# Altium schematic sheet 0162_CPU PD BOM -2.SchDoc
size 848 x 558 mm
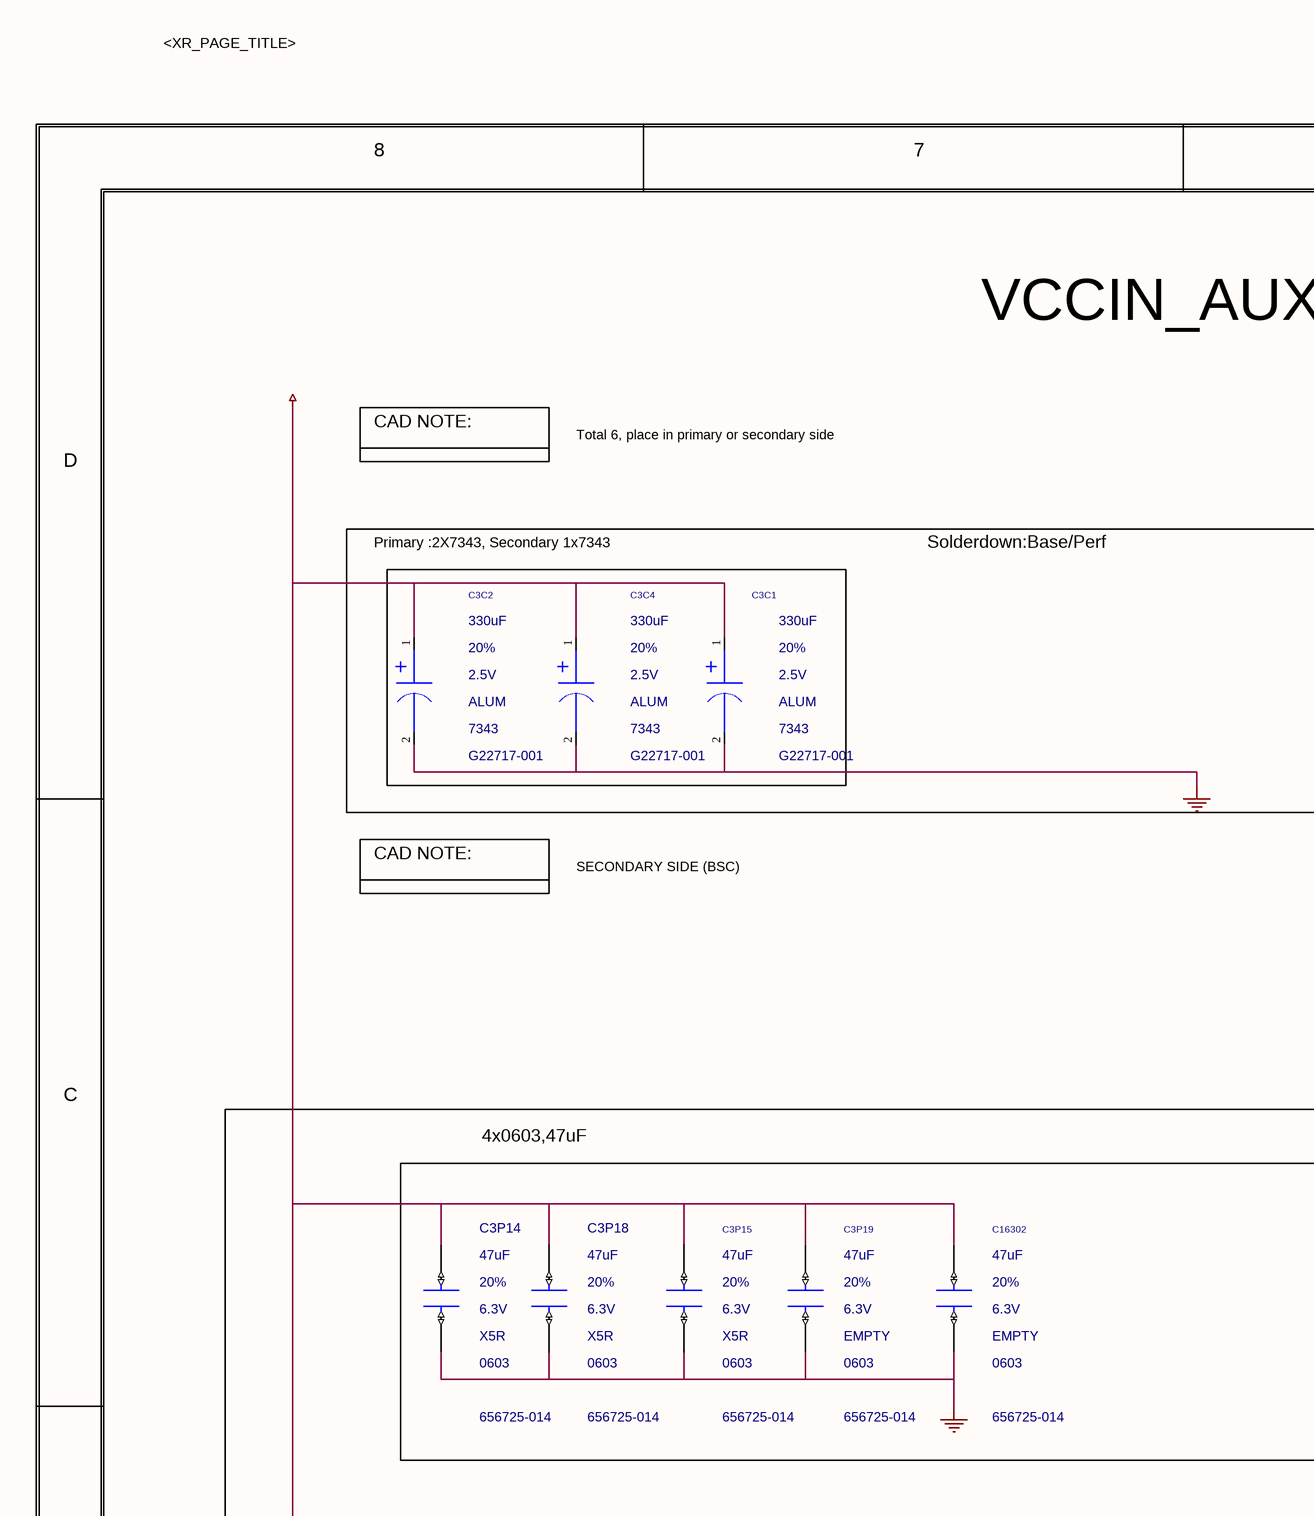
[diagram p0: 0162_CPU PD BOM -2.SchDoc, top left]
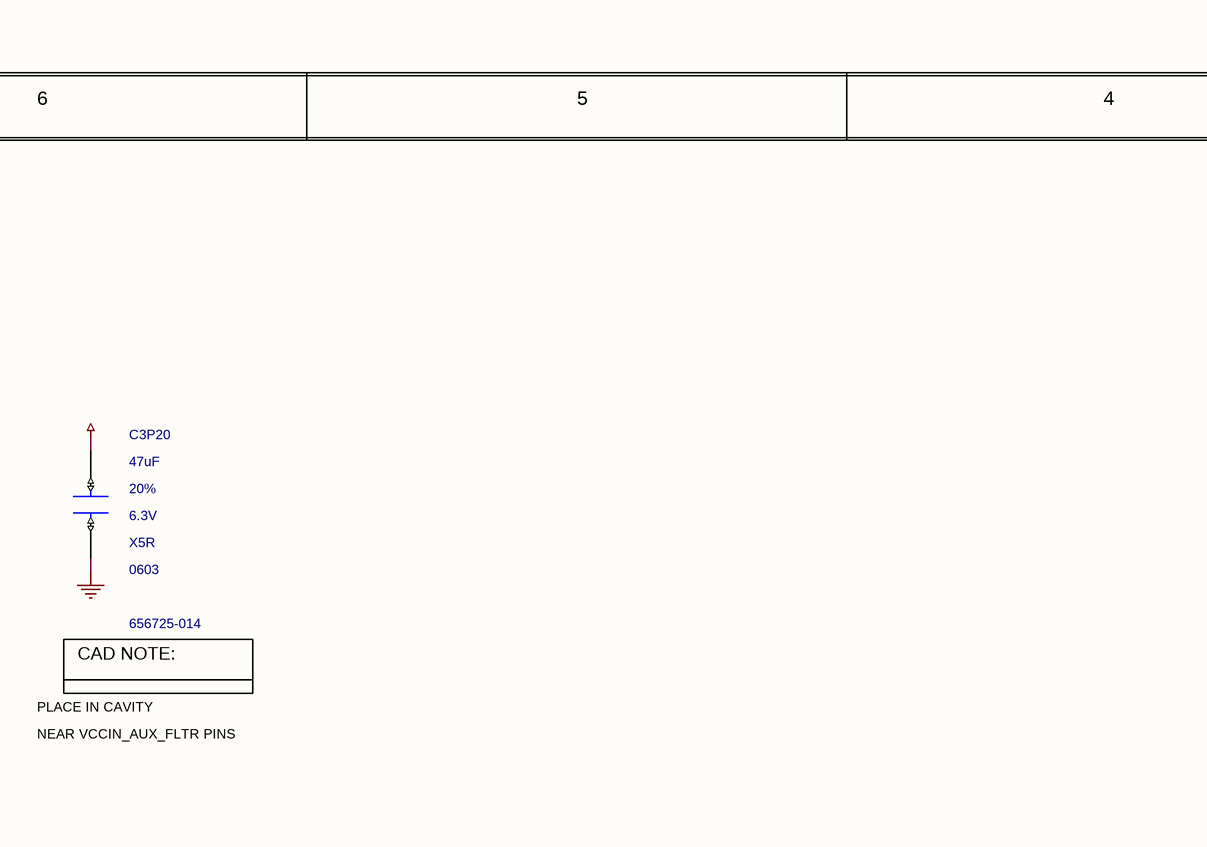
[diagram p1: 0162_CPU PD BOM -2.SchDoc, top middle]
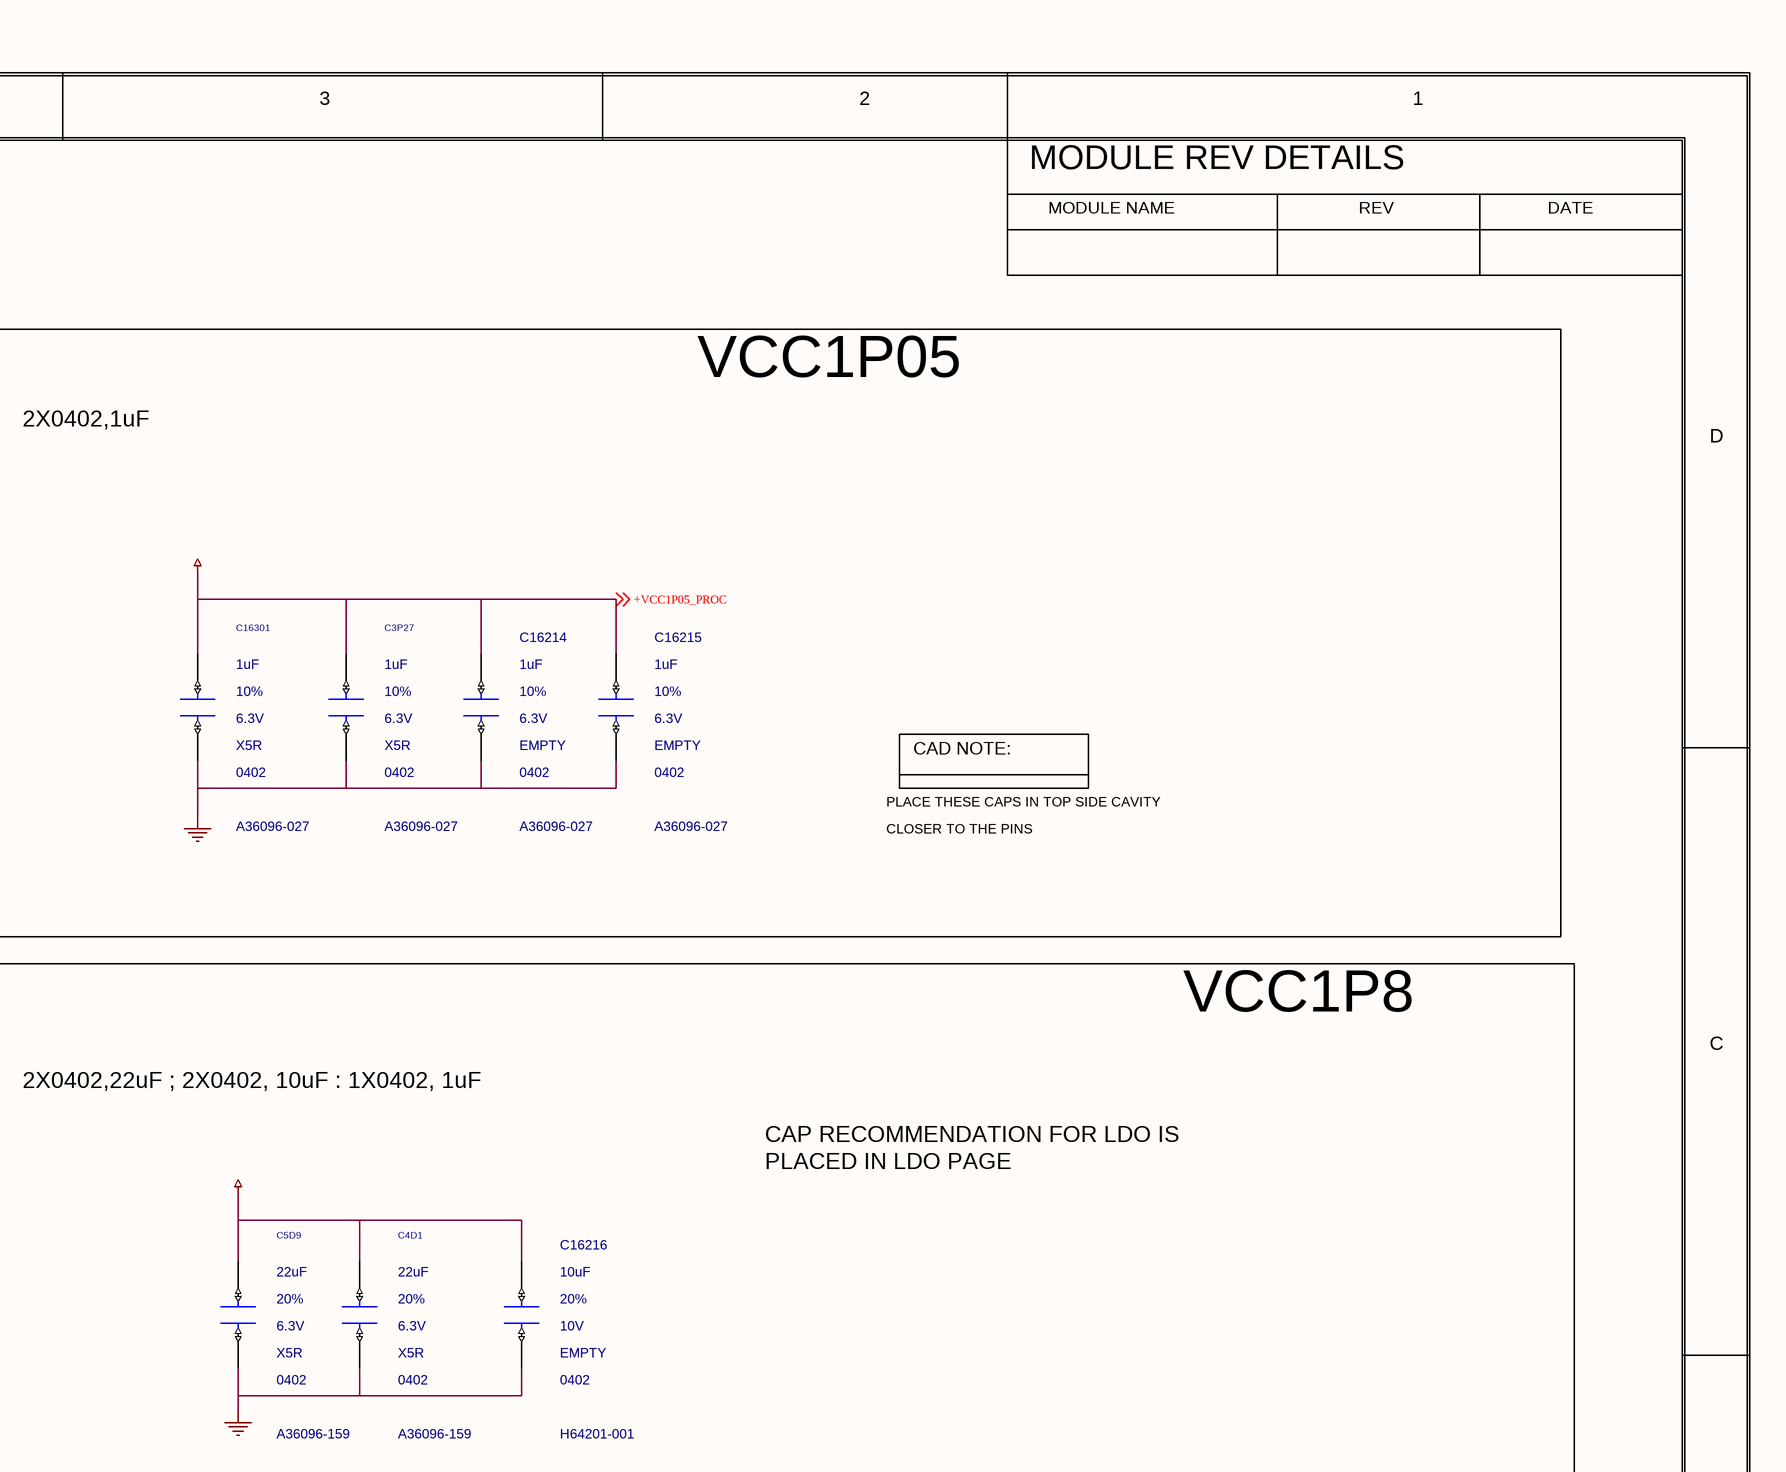
[diagram p2: 0162_CPU PD BOM -2.SchDoc, top right]
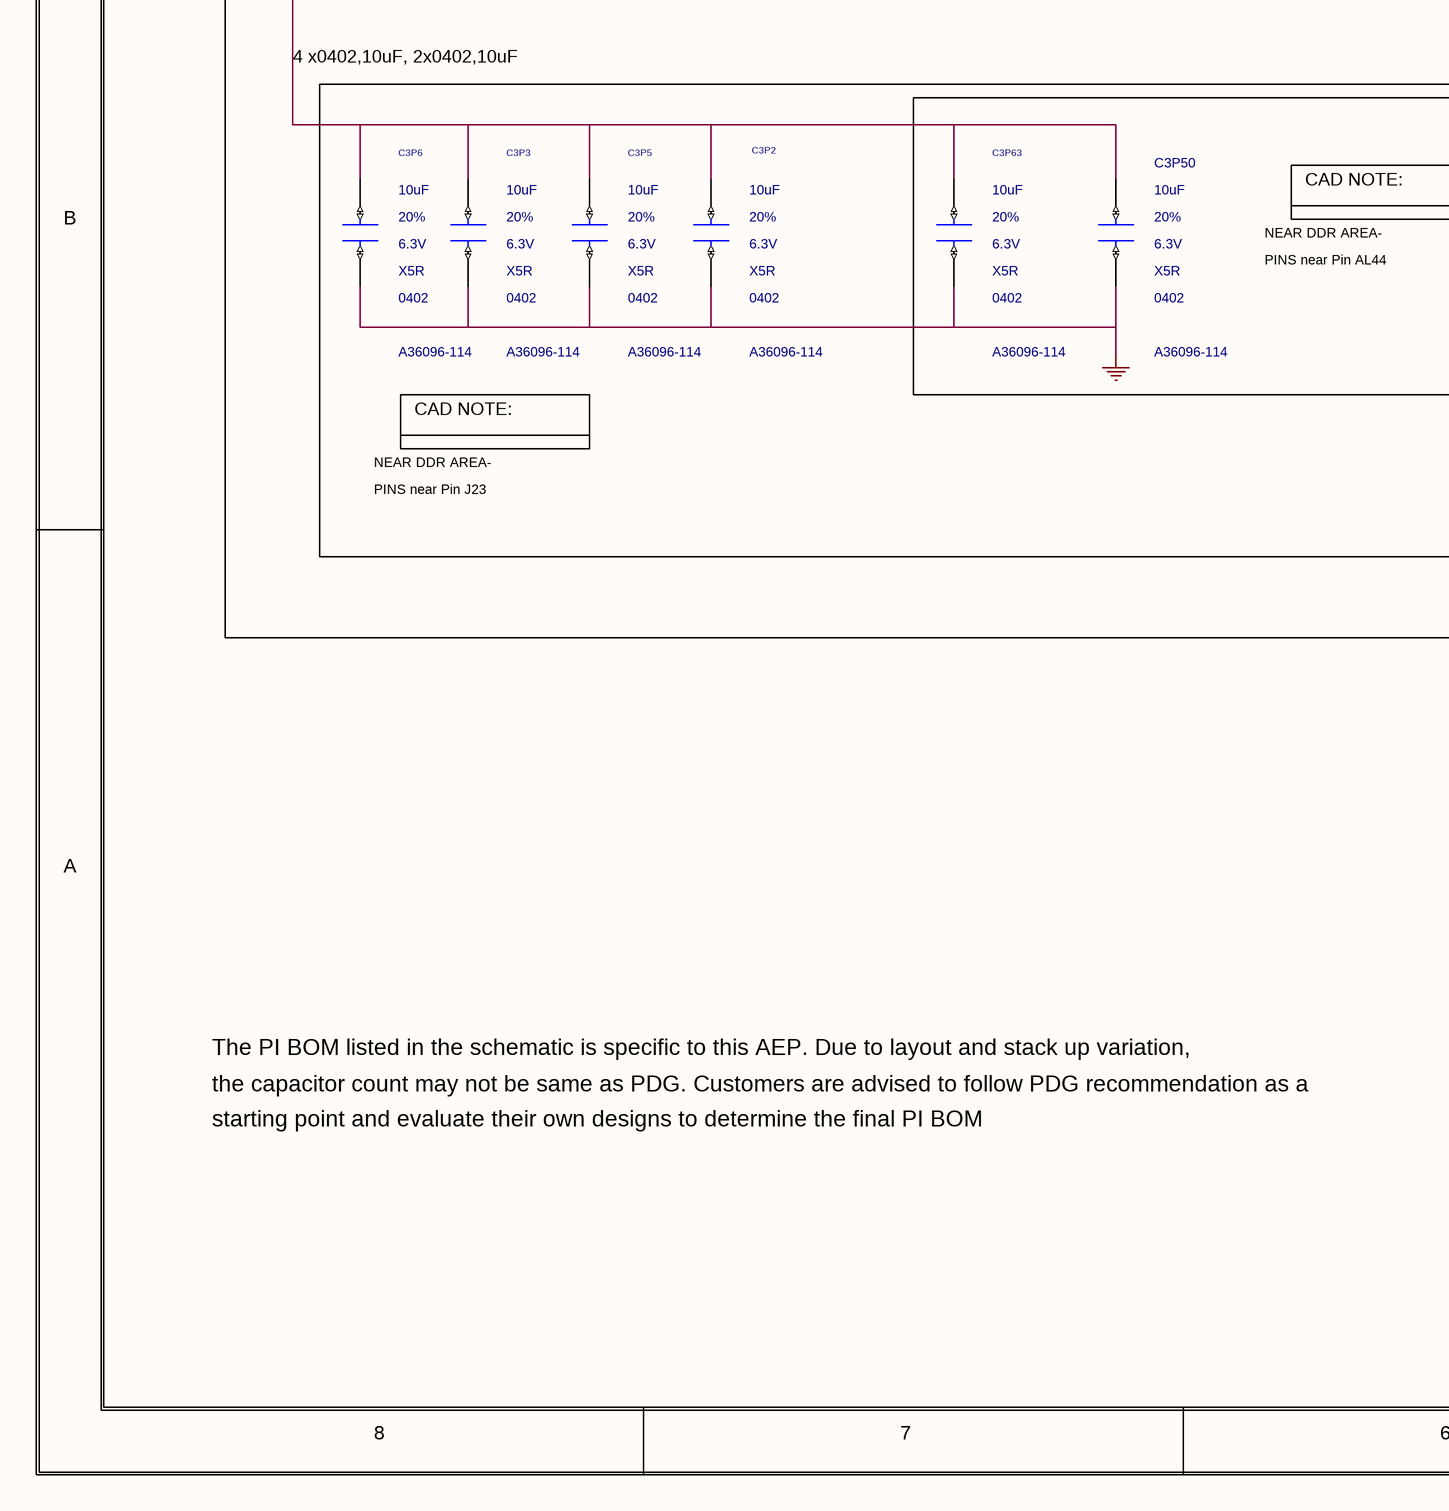
[diagram p3: 0162_CPU PD BOM -2.SchDoc, bottom left]
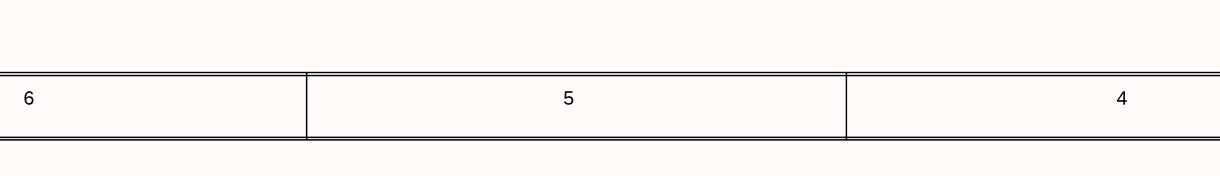
[diagram p4: 0162_CPU PD BOM -2.SchDoc, bottom middle]
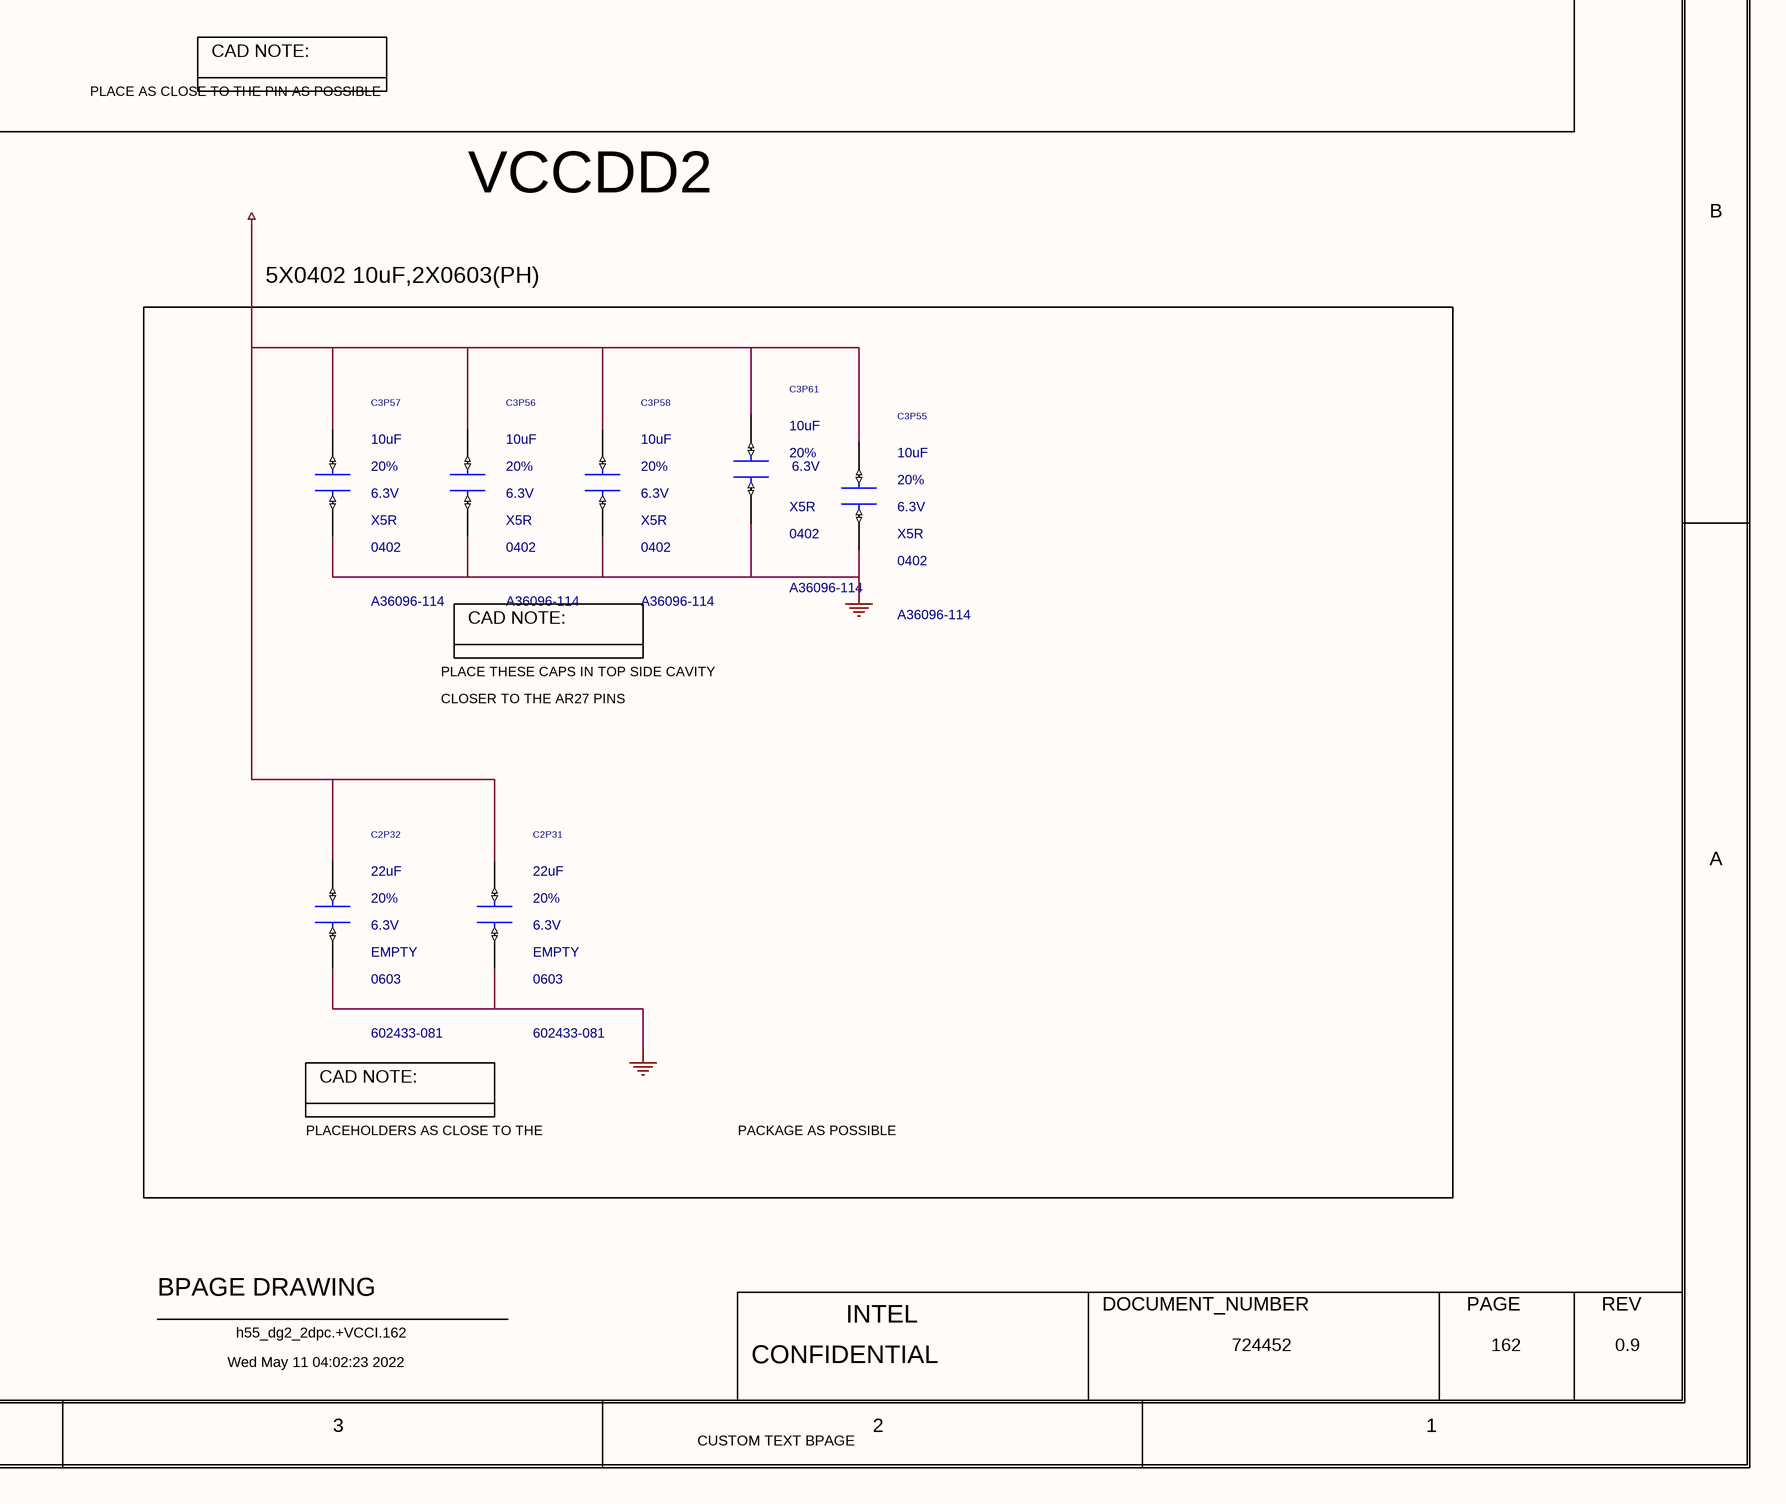
[diagram p5: 0162_CPU PD BOM -2.SchDoc, bottom right]

## Parts
C2P31  22uF  MATERIAL: EMPTY  PACK_TYPE: 0603  PART_NUMBER: 602433-081  TOLERANCE: 20%  VOLTAGE: 6.3V  [CTK0_SM0603_1800X1000_MA]
C2P32  22uF  MATERIAL: EMPTY  PACK_TYPE: 0603  PART_NUMBER: 602433-081  TOLERANCE: 20%  VOLTAGE: 6.3V  [CTK0_SM0603_1800X1000_MA]
C3C1  330uF  MATERIAL: ALUM  PACK_TYPE: 7343  PART_NUMBER: G22717-001  TOLERANCE: 20%  VOLTAGE: 2.5V  [TK0_SMC7343_7500X4500_ALEL_MA]
C3C2  330uF  MATERIAL: ALUM  PACK_TYPE: 7343  PART_NUMBER: G22717-001  TOLERANCE: 20%  VOLTAGE: 2.5V  [TK0_SMC7343_7500X4500_ALEL_MA]
C3C4  330uF  MATERIAL: ALUM  PACK_TYPE: 7343  PART_NUMBER: G22717-001  TOLERANCE: 20%  VOLTAGE: 2.5V  [TK0_SMC7343_7500X4500_ALEL_MA]
C3P2  10uF  MATERIAL: X5R  PACK_TYPE: 0402  PART_NUMBER: A36096-114  TOLERANCE: 20%  VOLTAGE: 6.3V  [CTK0_SM0402_1200X700_MA]
C3P3  10uF  MATERIAL: X5R  PACK_TYPE: 0402  PART_NUMBER: A36096-114  TOLERANCE: 20%  VOLTAGE: 6.3V  [CTK0_SM0402_1200X700_MA]
C3P5  10uF  MATERIAL: X5R  PACK_TYPE: 0402  PART_NUMBER: A36096-114  TOLERANCE: 20%  VOLTAGE: 6.3V  [CTK0_SM0402_1200X700_MA]
C3P6  10uF  MATERIAL: X5R  PACK_TYPE: 0402  PART_NUMBER: A36096-114  TOLERANCE: 20%  VOLTAGE: 6.3V  [CTK0_SM0402_1200X700_MA]
C3P14  47uF  MATERIAL: X5R  PACK_TYPE: 0603  PART_NUMBER: 656725-014  TOLERANCE: 20%  VOLTAGE: 6.3V  [CTK0_SM0603_1800X1000_MA]
C3P15  47uF  MATERIAL: X5R  PACK_TYPE: 0603  PART_NUMBER: 656725-014  TOLERANCE: 20%  VOLTAGE: 6.3V  [CTK0_SM0603_1800X1000_MA]
C3P18  47uF  MATERIAL: X5R  PACK_TYPE: 0603  PART_NUMBER: 656725-014  TOLERANCE: 20%  VOLTAGE: 6.3V  [CTK0_SM0603_1800X1000_MA]
C3P19  47uF  MATERIAL: EMPTY  PACK_TYPE: 0603  PART_NUMBER: 656725-014  TOLERANCE: 20%  VOLTAGE: 6.3V  [CTK0_SM0603_1800X1000_MA]
C3P20  47uF  MATERIAL: X5R  PACK_TYPE: 0603  PART_NUMBER: 656725-014  TOLERANCE: 20%  VOLTAGE: 6.3V  [CTK0_SM0603_1800X1000_MA]
C3P27  1uF  MATERIAL: X5R  PACK_TYPE: 0402  PART_NUMBER: A36096-027  TOLERANCE: 10%  VOLTAGE: 6.3V  [CTK0_SM0402_1050X550_MA]
C3P50  10uF  MATERIAL: X5R  PACK_TYPE: 0402  PART_NUMBER: A36096-114  TOLERANCE: 20%  VOLTAGE: 6.3V  [CTK0_SM0402_1200X700_MA]
C3P55  10uF  MATERIAL: X5R  PACK_TYPE: 0402  PART_NUMBER: A36096-114  TOLERANCE: 20%  VOLTAGE: 6.3V  [CTK0_SM0402_1200X700_MA]
C3P56  10uF  MATERIAL: X5R  PACK_TYPE: 0402  PART_NUMBER: A36096-114  TOLERANCE: 20%  VOLTAGE: 6.3V  [CTK0_SM0402_1200X700_MA]
C3P57  10uF  MATERIAL: X5R  PACK_TYPE: 0402  PART_NUMBER: A36096-114  TOLERANCE: 20%  VOLTAGE: 6.3V  [CTK0_SM0402_1200X700_MA]
C3P58  10uF  MATERIAL: X5R  PACK_TYPE: 0402  PART_NUMBER: A36096-114  TOLERANCE: 20%  VOLTAGE: 6.3V  [CTK0_SM0402_1200X700_MA]
C3P61  10uF  MATERIAL: X5R  PACK_TYPE: 0402  PART_NUMBER: A36096-114  TOLERANCE: 20%  VOLTAGE: 6.3V  [CTK0_SM0402_1200X700_MA]
C3P63  10uF  MATERIAL: X5R  PACK_TYPE: 0402  PART_NUMBER: A36096-114  TOLERANCE: 20%  VOLTAGE: 6.3V  [CTK0_SM0402_1200X700_MA]
C4D1  22uF  MATERIAL: X5R  PACK_TYPE: 0402  PART_NUMBER: A36096-159  TOLERANCE: 20%  VOLTAGE: 6.3V  [CTK0_SM0402_1300X800_MA]
C5D9  22uF  MATERIAL: X5R  PACK_TYPE: 0402  PART_NUMBER: A36096-159  TOLERANCE: 20%  VOLTAGE: 6.3V  [CTK0_SM0402_1300X800_MA]
C16214  1uF  MATERIAL: EMPTY  PACK_TYPE: 0402  PART_NUMBER: A36096-027  TOLERANCE: 10%  VOLTAGE: 6.3V  [CTK0_SM0402_1050X550_MA]
C16215  1uF  MATERIAL: EMPTY  PACK_TYPE: 0402  PART_NUMBER: A36096-027  TOLERANCE: 10%  VOLTAGE: 6.3V  [CTK0_SM0402_1050X550_MA]
C16216  10uF  MATERIAL: EMPTY  PACK_TYPE: 0402  PART_NUMBER: H64201-001  TOLERANCE: 20%  VOLTAGE: 10V  [CTK2_SM0402_1200X700_MA]
C16301  1uF  MATERIAL: X5R  PACK_TYPE: 0402  PART_NUMBER: A36096-027  TOLERANCE: 10%  VOLTAGE: 6.3V  [CTK0_SM0402_1050X550_MA]
C16302  47uF  MATERIAL: EMPTY  PACK_TYPE: 0603  PART_NUMBER: 656725-014  TOLERANCE: 20%  VOLTAGE: 6.3V  [CTK0_SM0603_1800X1000_MA]

## Blocks framed on the sheet
VCC1P05: C3P27 C16214 C16215 C16301
Solderdown:Base/Perf: C3C1 C3C2 C3C4
VCC1P8: C4D1 C5D9 C16216
4x0603,47uF: C3P14 C3P15 C3P18 C3P19 C16302
CAD NOTE:: C3P2 C3P3 C3P5 C3P6
CAD NOTE:: C3P50 C3P63
5X0402 10uF,2X0603(PH): C2P31 C2P32 C3P55-C3P58 C3P61

## Nets
+VCC1P05_PROC: C3P27.1(A) C16214.1(A) C16215.1(A) C16301.1(A) ; off-sheet +VCC1P05_PROC
+VCC1P8_PROC: C4D1.1(A) C5D9.1(A) C16216.1(A)
+VCCDD2_PROC: C2P31.1(A) C2P32.1(A) C3P55.1(A) C3P56.1(A) C3P57.1(A) C3P58.1(A) C3P61.1(A)
+VCCIN_AUX_FLTR: C3P20.1(A)
+VCCIN_AUX_PROC: C3C1.1(A) C3C2.1(A) C3C4.1(A) C3P2.1(A) C3P3.1(A) C3P5.1(A) C3P6.1(A) C3P14.1(A) C3P15.1(A) C3P18.1(A) C3P19.1(A) C3P50.1(A) C3P63.1(A) C16302.1(A)
GND: C2P31.2(B) C2P32.2(B) C3C1.2(B) C3C2.2(B) C3C4.2(B) C3P2.2(B) C3P3.2(B) C3P5.2(B) C3P6.2(B) C3P14.2(B) C3P15.2(B) C3P18.2(B) C3P19.2(B) C3P20.2(B) C3P27.2(B) C3P50.2(B) C3P55.2(B) C3P56.2(B) C3P57.2(B) C3P58.2(B) C3P61.2(B) C3P63.2(B) C4D1.2(B) C5D9.2(B) C16214.2(B) C16215.2(B) C16216.2(B) C16301.2(B) C16302.2(B)

## Notes on the sheet
- <XR_PAGE_TITLE>
- 8
- 7
- 6
- 5
- 4
- 3
- 2
- 1
- MODULE REV DETAILS
- MODULE NAME
- REV
- DATE
- VCCIN_AUX
- CAD NOTE:
- Total 6, place in primary or secondary side
- D
- 2X0402,1uF
- Primary :2X7343, Secondary 1x7343
- PLACE IN CAVITY
- NEAR VCCIN_AUX_FLTR PINS
- PLACE THESE CAPS IN TOP SIDE CAVITY
- SECONDARY SIDE (BSC)
- CLOSER TO THE PINS
- C
- 2X0402,22uF ; 2X0402, 10uF : 1X0402, 1uF
- CAP RECOMMENDATION FOR LDO IS
- PLACED IN LDO PAGE
- 4 x0402,10uF, 2x0402,10uF
- PLACE AS CLOSE TO THE PIN AS POSSIBLE
- B
- NEAR DDR AREA-
- VCCDD2
- PINS near Pin AL44
- PINS near Pin J23
- CLOSER TO THE AR27 PINS
- A
- The PI BOM listed in the schematic is specific to this AEP. Due to layout and stack up variation,
- starting point and evaluate their own designs to determine the final PI BOM
- the capacitor count may not be same as PDG. Customers are advised to follow PDG recommendation as a
- PLACEHOLDERS AS CLOSE TO THE
- PACKAGE AS POSSIBLE
- BPAGE DRAWING
- INTEL
- DOCUMENT_NUMBER
- PAGE
- Wed May 11 04:02:23 2022
- h55_dg2_2dpc.+VCCI.162
- CONFIDENTIAL
- 724452
- 162
- 0.9
- CUSTOM TEXT BPAGE

## Library data of the parts
C2P31 = C_CAP: CDS_PHYS_PART_NAME: C_CAP_0603-602433-081,EMPTY,22UF,6.3V,20%,TK0,GENERIC; CDS_LMAN_SYM_OUTLINE: -50,50,50,-50; FP_TECH: TK0; IP: GENERIC; ROOM: NONE; OriginalSymbolOrigin: (-50,25); XY: (-500,2075); VER: 1; ROT: 0; PHYS_PAGE: 162; LOCATION: C2P31; FIN: VREG_CPU_DCPL; DRAWING: @RVP1_ADL_SB_ADP_S_DDR5_SODIMM_2DPC_LIB.H55_DG2_2DPC(SCH_1):PAGE531; CDS_LIB: c_discrete; BOM: CORE_VREG_CPU; VARIANT: ?; PCB Footprint: CTK0_SM0603_1800X1000_MA; CHIPS_PART_NAME: C_CAP; CDS_PART_NAME: C_CAP_0603-602433-081,EMPTY,22UF,6.3V,20%,TK0,GENERIC; CDS_LOCATION: C2P31
C2P32 = C_CAP: CDS_PHYS_PART_NAME: C_CAP_0603-602433-081,EMPTY,22UF,6.3V,20%,TK0,GENERIC; CDS_LMAN_SYM_OUTLINE: -50,50,50,-50; FP_TECH: TK0; IP: GENERIC; ROOM: NONE; OriginalSymbolOrigin: (-50,25); XY: (-800,2075); VER: 1; ROT: 0; PHYS_PAGE: 162; LOCATION: C2P32; FIN: VREG_CPU_DCPL; DRAWING: @RVP1_ADL_SB_ADP_S_DDR5_SODIMM_2DPC_LIB.H55_DG2_2DPC(SCH_1):PAGE531; CDS_LIB: c_discrete; BOM: CORE_VREG_CPU; VARIANT: ?; PCB Footprint: CTK0_SM0603_1800X1000_MA; CHIPS_PART_NAME: C_CAP; CDS_PART_NAME: C_CAP_0603-602433-081,EMPTY,22UF,6.3V,20%,TK0,GENERIC; CDS_LOCATION: C2P32
C3C1 = CAPP_2: CDS_PHYS_PART_NAME: CAPP_2_7343-G22717-001,ALUM,330UF,2.5V,20%,TK0,GENERIC; BOM_USE: STUFF; CDS_LMAN_SYM_OUTLINE: -50,100,50,-50; FP_TECH: TK0; IP: GENERIC; ROOM: NONE; OriginalSymbolOrigin: (-50,75); XY: (-5150,5250); VER: 1; ROT: 0; PHYS_PAGE: 162; LOCATION: C3C1; DRAWING: @RVP1_ADL_SB_ADP_S_DDR5_SODIMM_2DPC_LIB.H55_DG2_2DPC(SCH_1):PAGE531; CDS_LIB: discrete_2; VARIANT: ?; PCB Footprint: TK0_SMC7343_7500X4500_ALEL_MA; CHIPS_PART_NAME: CAPP_2; CDS_PART_NAME: CAPP_2_7343-G22717-001,ALUM,330UF,2.5V,20%,TK0,GENERIC; CDS_LOCATION: C3C1; ASI_MODEL: G22717-001
C3C2 = CAPP_2: CDS_PHYS_PART_NAME: CAPP_2_7343-G22717-001,ALUM,330UF,2.5V,20%,TK0,GENERIC; BOM_USE: STUFF; CDS_LMAN_SYM_OUTLINE: -50,100,50,-50; FP_TECH: TK0; IP: GENERIC; ROOM: NONE; OriginalSymbolOrigin: (-50,75); XY: (-5725,5250); VER: 1; ROT: 0; PHYS_PAGE: 162; LOCATION: C3C2; DRAWING: @RVP1_ADL_SB_ADP_S_DDR5_SODIMM_2DPC_LIB.H55_DG2_2DPC(SCH_1):PAGE531; CDS_LIB: discrete_2; VARIANT: ?; PCB Footprint: TK0_SMC7343_7500X4500_ALEL_MA; CHIPS_PART_NAME: CAPP_2; CDS_PART_NAME: CAPP_2_7343-G22717-001,ALUM,330UF,2.5V,20%,TK0,GENERIC; CDS_LOCATION: C3C2; ASI_MODEL: G22717-001
C3C4 = CAPP_2: CDS_PHYS_PART_NAME: CAPP_2_7343-G22717-001,ALUM,330UF,2.5V,20%,TK0,GENERIC; BOM_USE: STUFF; CDS_LMAN_SYM_OUTLINE: -50,100,50,-50; FP_TECH: TK0; IP: GENERIC; ROOM: NONE; OriginalSymbolOrigin: (-50,75); XY: (-5425,5250); VER: 1; ROT: 0; PHYS_PAGE: 162; LOCATION: C3C4; DRAWING: @RVP1_ADL_SB_ADP_S_DDR5_SODIMM_2DPC_LIB.H55_DG2_2DPC(SCH_1):PAGE531; CDS_LIB: discrete_2; VARIANT: ?; PCB Footprint: TK0_SMC7343_7500X4500_ALEL_MA; CHIPS_PART_NAME: CAPP_2; CDS_PART_NAME: CAPP_2_7343-G22717-001,ALUM,330UF,2.5V,20%,TK0,GENERIC; CDS_LOCATION: C3C4; ASI_MODEL: G22717-001
C3P2 = C_CAP: CDS_PHYS_PART_NAME: C_CAP_0402-A36096-114,X5R,10UF,6.3V,20%,TK0,GENERIC; CDS_LMAN_SYM_OUTLINE: -50,50,50,-50; FP_TECH: TK0; IP: GENERIC; ROOM: NONE; OriginalSymbolOrigin: (-50,25); XY: (-5175,3350); VER: 1; ROT: 0; PHYS_PAGE: 162; LOCATION: C3P2; FIN: VREG_CPU_DCPL; DRAWING: @RVP1_ADL_SB_ADP_S_DDR5_SODIMM_2DPC_LIB.H55_DG2_2DPC(SCH_1):PAGE531; CDS_LIB: c_discrete; BOM: CORE_VREG_CPU; VARIANT: ?; PCB Footprint: CTK0_SM0402_1200X700_MA; CHIPS_PART_NAME: C_CAP; CDS_PART_NAME: C_CAP_0402-A36096-114,X5R,10UF,6.3V,20%,TK0,GENERIC; CDS_LOCATION: C3P2
C3P3 = C_CAP: CDS_PHYS_PART_NAME: C_CAP_0402-A36096-114,X5R,10UF,6.3V,20%,TK0,GENERIC; CDS_LMAN_SYM_OUTLINE: -50,50,50,-50; FP_TECH: TK0; IP: GENERIC; ROOM: NONE; OriginalSymbolOrigin: (-50,25); XY: (-5625,3350); VER: 1; ROT: 0; PHYS_PAGE: 162; LOCATION: C3P3; FIN: VREG_CPU_DCPL; DRAWING: @RVP1_ADL_SB_ADP_S_DDR5_SODIMM_2DPC_LIB.H55_DG2_2DPC(SCH_1):PAGE531; CDS_LIB: c_discrete; BOM: CORE_VREG_CPU; VARIANT: ?; PCB Footprint: CTK0_SM0402_1200X700_MA; CHIPS_PART_NAME: C_CAP; CDS_PART_NAME: C_CAP_0402-A36096-114,X5R,10UF,6.3V,20%,TK0,GENERIC; CDS_LOCATION: C3P3
C3P5 = C_CAP: CDS_PHYS_PART_NAME: C_CAP_0402-A36096-114,X5R,10UF,6.3V,20%,TK0,GENERIC; CDS_LMAN_SYM_OUTLINE: -50,50,50,-50; FP_TECH: TK0; IP: GENERIC; ROOM: NONE; OriginalSymbolOrigin: (-50,25); XY: (-5400,3350); VER: 1; ROT: 0; PHYS_PAGE: 162; LOCATION: C3P5; FIN: VREG_CPU_DCPL; DRAWING: @RVP1_ADL_SB_ADP_S_DDR5_SODIMM_2DPC_LIB.H55_DG2_2DPC(SCH_1):PAGE531; CDS_LIB: c_discrete; BOM: CORE_VREG_CPU; VARIANT: ?; PCB Footprint: CTK0_SM0402_1200X700_MA; CHIPS_PART_NAME: C_CAP; CDS_PART_NAME: C_CAP_0402-A36096-114,X5R,10UF,6.3V,20%,TK0,GENERIC; CDS_LOCATION: C3P5
C3P6 = C_CAP: CDS_PHYS_PART_NAME: C_CAP_0402-A36096-114,X5R,10UF,6.3V,20%,TK0,GENERIC; CDS_LMAN_SYM_OUTLINE: -50,50,50,-50; FP_TECH: TK0; IP: GENERIC; ROOM: NONE; OriginalSymbolOrigin: (-50,25); XY: (-5825,3350); VER: 1; ROT: 0; PHYS_PAGE: 162; LOCATION: C3P6; FIN: VREG_CPU_DCPL; DRAWING: @RVP1_ADL_SB_ADP_S_DDR5_SODIMM_2DPC_LIB.H55_DG2_2DPC(SCH_1):PAGE531; CDS_LIB: c_discrete; BOM: CORE_VREG_CPU; VARIANT: ?; PCB Footprint: CTK0_SM0402_1200X700_MA; CHIPS_PART_NAME: C_CAP; CDS_PART_NAME: C_CAP_0402-A36096-114,X5R,10UF,6.3V,20%,TK0,GENERIC; CDS_LOCATION: C3P6
C3P14 = C_CAP: CDS_PHYS_PART_NAME: C_CAP_0603-656725-014,X5R,47UF,6.3V,20%,TK0,GENERIC; CDS_LMAN_SYM_OUTLINE: -50,50,50,-50; FP_TECH: TK0; IP: GENERIC; ROOM: NONE; OriginalSymbolOrigin: (-50,25); XY: (-5675,4125); VER: 1; ROT: 0; PHYS_PAGE: 162; LOCATION: C3P14; DRAWING: @RVP1_ADL_SB_ADP_S_DDR5_SODIMM_2DPC_LIB.H55_DG2_2DPC(SCH_1):PAGE531; CDS_LIB: c_discrete; VARIANT: ?; PCB Footprint: CTK0_SM0603_1800X1000_MA; CHIPS_PART_NAME: C_CAP; CDS_PART_NAME: C_CAP_0603-656725-014,X5R,47UF,6.3V,20%,TK0,GENERIC; CDS_LOCATION: C3P14
C3P15 = C_CAP: CDS_PHYS_PART_NAME: C_CAP_0603-656725-014,X5R,47UF,6.3V,20%,TK0,GENERIC; CDS_LMAN_SYM_OUTLINE: -50,50,50,-50; FP_TECH: TK0; IP: GENERIC; ROOM: NONE; OriginalSymbolOrigin: (-50,25); XY: (-5225,4125); VER: 1; ROT: 0; PHYS_PAGE: 162; LOCATION: C3P15; DRAWING: @RVP1_ADL_SB_ADP_S_DDR5_SODIMM_2DPC_LIB.H55_DG2_2DPC(SCH_1):PAGE531; CDS_LIB: c_discrete; VARIANT: ?; PCB Footprint: CTK0_SM0603_1800X1000_MA; CHIPS_PART_NAME: C_CAP; CDS_PART_NAME: C_CAP_0603-656725-014,X5R,47UF,6.3V,20%,TK0,GENERIC; CDS_LOCATION: C3P15
C3P18 = C_CAP: CDS_PHYS_PART_NAME: C_CAP_0603-656725-014,X5R,47UF,6.3V,20%,TK0,GENERIC; CDS_LMAN_SYM_OUTLINE: -50,50,50,-50; FP_TECH: TK0; IP: GENERIC; ROOM: NONE; OriginalSymbolOrigin: (-50,25); XY: (-5475,4125); VER: 1; ROT: 0; PHYS_PAGE: 162; LOCATION: C3P18; DRAWING: @RVP1_ADL_SB_ADP_S_DDR5_SODIMM_2DPC_LIB.H55_DG2_2DPC(SCH_1):PAGE531; CDS_LIB: c_discrete; VARIANT: ?; PCB Footprint: CTK0_SM0603_1800X1000_MA; CHIPS_PART_NAME: C_CAP; CDS_PART_NAME: C_CAP_0603-656725-014,X5R,47UF,6.3V,20%,TK0,GENERIC; CDS_LOCATION: C3P18
C3P19 = C_CAP: CDS_PHYS_PART_NAME: C_CAP_0603-656725-014,EMPTY,47UF,6.3V,20%,TK0,GENERIC; CDS_LMAN_SYM_OUTLINE: -50,50,50,-50; FP_TECH: TK0; IP: GENERIC; ROOM: NONE; OriginalSymbolOrigin: (-50,25); XY: (-5000,4125); VER: 1; ROT: 0; PHYS_PAGE: 162; LOCATION: C3P19; DRAWING: @RVP1_ADL_SB_ADP_S_DDR5_SODIMM_2DPC_LIB.H55_DG2_2DPC(SCH_1):PAGE531; CDS_LIB: c_discrete; VARIANT: ?; PCB Footprint: CTK0_SM0603_1800X1000_MA; CHIPS_PART_NAME: C_CAP; CDS_PART_NAME: C_CAP_0603-656725-014,EMPTY,47UF,6.3V,20%,TK0,GENERIC; CDS_LOCATION: C3P19
C3P20 = C_CAP: CDS_PHYS_PART_NAME: C_CAP_0603-656725-014,X5R,47UF,6.3V,20%,TK0,GENERIC; CDS_LMAN_SYM_OUTLINE: -50,50,50,-50; FP_TECH: TK0; IP: GENERIC; ROOM: NONE; OriginalSymbolOrigin: (-50,25); XY: (-3700,5500); VER: 1; ROT: 0; PHYS_PAGE: 162; LOCATION: C3P20; DRAWING: @RVP1_ADL_SB_ADP_S_DDR5_SODIMM_2DPC_LIB.H55_DG2_2DPC(SCH_1):PAGE531; CDS_LIB: c_discrete; VARIANT: ?; PCB Footprint: CTK0_SM0603_1800X1000_MA; CHIPS_PART_NAME: C_CAP; CDS_PART_NAME: C_CAP_0603-656725-014,X5R,47UF,6.3V,20%,TK0,GENERIC; CDS_LOCATION: C3P20
C3P27 = C_CAP: CDS_PHYS_PART_NAME: C_CAP_0402-A36096-027,X5R,1UF,6.3V,10%,TK0,GENERIC; CDS_LMAN_SYM_OUTLINE: -50,50,50,-50; FP_TECH: TK0; IP: GENERIC; ROOM: NONE; OriginalSymbolOrigin: (-50,25); XY: (-775,5125); VER: 1; ROT: 0; PHYS_PAGE: 162; LOCATION: C3P27; FIN: VREG_CPU_DCPL; DRAWING: @RVP1_ADL_SB_ADP_S_DDR5_SODIMM_2DPC_LIB.H55_DG2_2DPC(SCH_1):PAGE531; CDS_LIB: c_discrete; BOM: CORE_VREG_CPU; VARIANT: ?; PCB Footprint: CTK0_SM0402_1050X550_MA; CHIPS_PART_NAME: C_CAP; CDS_PART_NAME: C_CAP_0402-A36096-027,X5R,1UF,6.3V,10%,TK0,GENERIC; CDS_LOCATION: C3P27
C3P50 = C_CAP: CDS_PHYS_PART_NAME: C_CAP_0402-A36096-114,X5R,10UF,6.3V,20%,TK0,GENERIC; CDS_LMAN_SYM_OUTLINE: -50,50,50,-50; FP_TECH: TK0; IP: GENERIC; ROOM: NONE; OriginalSymbolOrigin: (-50,25); XY: (-4425,3350); VER: 1; ROT: 0; PHYS_PAGE: 162; LOCATION: C3P50; DRAWING: @RVP1_ADL_SB_ADP_S_DDR5_SODIMM_2DPC_LIB.H55_DG2_2DPC(SCH_1):PAGE531; CDS_LIB: c_discrete; VARIANT: ?; PCB Footprint: CTK0_SM0402_1200X700_MA; CHIPS_PART_NAME: C_CAP; CDS_PART_NAME: C_CAP_0402-A36096-114,X5R,10UF,6.3V,20%,TK0,GENERIC; CDS_LOCATION: C3P50
C3P55 = C_CAP: CDS_PHYS_PART_NAME: C_CAP_0402-A36096-114,X5R,10UF,6.3V,20%,TK0,GENERIC; CDS_LMAN_SYM_OUTLINE: -50,50,50,-50; FP_TECH: TK0; IP: GENERIC; ROOM: NONE; OriginalSymbolOrigin: (-50,25); XY: (175,2850); VER: 1; ROT: 0; PHYS_PAGE: 162; LOCATION: C3P55; DRAWING: @RVP1_ADL_SB_ADP_S_DDR5_SODIMM_2DPC_LIB.H55_DG2_2DPC(SCH_1):PAGE531; CDS_LIB: c_discrete; VARIANT: ?; PCB Footprint: CTK0_SM0402_1200X700_MA; CHIPS_PART_NAME: C_CAP; CDS_PART_NAME: C_CAP_0402-A36096-114,X5R,10UF,6.3V,20%,TK0,GENERIC; CDS_LOCATION: C3P55
C3P56 = C_CAP: CDS_PHYS_PART_NAME: C_CAP_0402-A36096-114,X5R,10UF,6.3V,20%,TK0,GENERIC; CDS_LMAN_SYM_OUTLINE: -50,50,50,-50; FP_TECH: TK0; IP: GENERIC; ROOM: NONE; OriginalSymbolOrigin: (-50,25); XY: (-550,2875); VER: 1; ROT: 0; PHYS_PAGE: 162; LOCATION: C3P56; DRAWING: @RVP1_ADL_SB_ADP_S_DDR5_SODIMM_2DPC_LIB.H55_DG2_2DPC(SCH_1):PAGE531; CDS_LIB: c_discrete; VARIANT: ?; PCB Footprint: CTK0_SM0402_1200X700_MA; CHIPS_PART_NAME: C_CAP; CDS_PART_NAME: C_CAP_0402-A36096-114,X5R,10UF,6.3V,20%,TK0,GENERIC; CDS_LOCATION: C3P56
C3P57 = C_CAP: CDS_PHYS_PART_NAME: C_CAP_0402-A36096-114,X5R,10UF,6.3V,20%,TK0,GENERIC; CDS_LMAN_SYM_OUTLINE: -50,50,50,-50; FP_TECH: TK0; IP: GENERIC; ROOM: NONE; OriginalSymbolOrigin: (-50,25); XY: (-800,2875); VER: 1; ROT: 0; PHYS_PAGE: 162; LOCATION: C3P57; DRAWING: @RVP1_ADL_SB_ADP_S_DDR5_SODIMM_2DPC_LIB.H55_DG2_2DPC(SCH_1):PAGE531; CDS_LIB: c_discrete; VARIANT: ?; PCB Footprint: CTK0_SM0402_1200X700_MA; CHIPS_PART_NAME: C_CAP; CDS_PART_NAME: C_CAP_0402-A36096-114,X5R,10UF,6.3V,20%,TK0,GENERIC; CDS_LOCATION: C3P57
C3P58 = C_CAP: CDS_PHYS_PART_NAME: C_CAP_0402-A36096-114,X5R,10UF,6.3V,20%,TK0,GENERIC; CDS_LMAN_SYM_OUTLINE: -50,50,50,-50; FP_TECH: TK0; IP: GENERIC; ROOM: NONE; OriginalSymbolOrigin: (-50,25); XY: (-300,2875); VER: 1; ROT: 0; PHYS_PAGE: 162; LOCATION: C3P58; DRAWING: @RVP1_ADL_SB_ADP_S_DDR5_SODIMM_2DPC_LIB.H55_DG2_2DPC(SCH_1):PAGE531; CDS_LIB: c_discrete; VARIANT: ?; PCB Footprint: CTK0_SM0402_1200X700_MA; CHIPS_PART_NAME: C_CAP; CDS_PART_NAME: C_CAP_0402-A36096-114,X5R,10UF,6.3V,20%,TK0,GENERIC; CDS_LOCATION: C3P58
C3P61 = C_CAP: CDS_PHYS_PART_NAME: C_CAP_0402-A36096-114,X5R,10UF,6.3V,20%,TK0,GENERIC; CDS_LMAN_SYM_OUTLINE: -50,50,50,-50; FP_TECH: TK0; IP: GENERIC; ROOM: NONE; OriginalSymbolOrigin: (-50,25); XY: (-25,2900); VER: 1; ROT: 0; PHYS_PAGE: 162; LOCATION: C3P61; DRAWING: @RVP1_ADL_SB_ADP_S_DDR5_SODIMM_2DPC_LIB.H55_DG2_2DPC(SCH_1):PAGE531; CDS_LIB: c_discrete; VARIANT: ?; PCB Footprint: CTK0_SM0402_1200X700_MA; CHIPS_PART_NAME: C_CAP; CDS_PART_NAME: C_CAP_0402-A36096-114,X5R,10UF,6.3V,20%,TK0,GENERIC; CDS_LOCATION: C3P61
C3P63 = C_CAP: CDS_PHYS_PART_NAME: C_CAP_0402-A36096-114,X5R,10UF,6.3V,20%,TK0,GENERIC; CDS_LMAN_SYM_OUTLINE: -50,50,50,-50; FP_TECH: TK0; IP: GENERIC; ROOM: NONE; OriginalSymbolOrigin: (-50,25); XY: (-4725,3350); VER: 1; ROT: 0; PHYS_PAGE: 162; LOCATION: C3P63; FIN: VREG_CPU_DCPL; DRAWING: @RVP1_ADL_SB_ADP_S_DDR5_SODIMM_2DPC_LIB.H55_DG2_2DPC(SCH_1):PAGE531; CDS_LIB: c_discrete; BOM: CORE_VREG_CPU; VARIANT: ?; PCB Footprint: CTK0_SM0402_1200X700_MA; CHIPS_PART_NAME: C_CAP; CDS_PART_NAME: C_CAP_0402-A36096-114,X5R,10UF,6.3V,20%,TK0,GENERIC; CDS_LOCATION: C3P63
C4D1 = C_CAP: CDS_PHYS_PART_NAME: C_CAP_0402-A36096-159,X5R,22UF,6.3V,20%,TK0,GENERIC; CDS_LMAN_SYM_OUTLINE: -50,50,50,-50; FP_TECH: TK0; IP: GENERIC; ROOM: NONE; OriginalSymbolOrigin: (-50,25); XY: (-750,4000); VER: 1; ROT: 0; PHYS_PAGE: 162; LOCATION: C4D1; FIN: VREG_CPU_DCPL; DRAWING: @RVP1_ADL_SB_ADP_S_DDR5_SODIMM_2DPC_LIB.H55_DG2_2DPC(SCH_1):PAGE531; CDS_LIB: c_discrete; BOM: CORE_VREG_CPU; VARIANT: ?; PCB Footprint: CTK0_SM0402_1300X800_MA; CHIPS_PART_NAME: C_CAP; CDS_PART_NAME: C_CAP_0402-A36096-159,X5R,22UF,6.3V,20%,TK0,GENERIC; CDS_LOCATION: C4D1
C5D9 = C_CAP: CDS_PHYS_PART_NAME: C_CAP_0402-A36096-159,X5R,22UF,6.3V,20%,TK0,GENERIC; CDS_LMAN_SYM_OUTLINE: -50,50,50,-50; FP_TECH: TK0; IP: GENERIC; ROOM: NONE; OriginalSymbolOrigin: (-50,25); XY: (-975,4000); VER: 1; ROT: 0; PHYS_PAGE: 162; LOCATION: C5D9; FIN: VREG_CPU_DCPL; DRAWING: @RVP1_ADL_SB_ADP_S_DDR5_SODIMM_2DPC_LIB.H55_DG2_2DPC(SCH_1):PAGE531; CDS_LIB: c_discrete; BOM: CORE_VREG_CPU; VARIANT: ?; PCB Footprint: CTK0_SM0402_1300X800_MA; CHIPS_PART_NAME: C_CAP; CDS_PART_NAME: C_CAP_0402-A36096-159,X5R,22UF,6.3V,20%,TK0,GENERIC; CDS_LOCATION: C5D9
C16214 = C_CAP: CDS_PHYS_PART_NAME: C_CAP_0402-A36096-027,EMPTY,1UF,6.3V,10%,TK0,GENERIC; CDS_LMAN_SYM_OUTLINE: -50,50,50,-50; FP_TECH: TK0; IP: GENERIC; ROOM: NONE; OriginalSymbolOrigin: (-50,25); XY: (-525,5125); VER: 1; ROT: 0; PHYS_PAGE: 162; LOCATION: C16214; FIN: VREG_CPU_DCPL; DRAWING: @RVP1_ADL_SB_ADP_S_DDR5_SODIMM_2DPC_LIB.H55_DG2_2DPC(SCH_1):PAGE531; CDS_LIB: c_discrete; BOM: CORE_VREG_CPU; VARIANT: ?; PCB Footprint: CTK0_SM0402_1050X550_MA; CHIPS_PART_NAME: C_CAP; CDS_PART_NAME: C_CAP_0402-A36096-027,EMPTY,1UF,6.3V,10%,TK0,GENERIC; CDS_LOCATION: C16214
C16215 = C_CAP: CDS_PHYS_PART_NAME: C_CAP_0402-A36096-027,EMPTY,1UF,6.3V,10%,TK0,GENERIC; CDS_LMAN_SYM_OUTLINE: -50,50,50,-50; FP_TECH: TK0; IP: GENERIC; ROOM: NONE; OriginalSymbolOrigin: (-50,25); XY: (-275,5125); VER: 1; ROT: 0; PHYS_PAGE: 162; LOCATION: C16215; FIN: VREG_CPU_DCPL; DRAWING: @RVP1_ADL_SB_ADP_S_DDR5_SODIMM_2DPC_LIB.H55_DG2_2DPC(SCH_1):PAGE531; CDS_LIB: c_discrete; BOM: CORE_VREG_CPU; VARIANT: ?; PCB Footprint: CTK0_SM0402_1050X550_MA; CHIPS_PART_NAME: C_CAP; CDS_PART_NAME: C_CAP_0402-A36096-027,EMPTY,1UF,6.3V,10%,TK0,GENERIC; CDS_LOCATION: C16215
C16216 = C_CAP: CDS_PHYS_PART_NAME: C_CAP_0402-H64201-001,EMPTY,10UF,10V,20%,TK2,GENERIC; CDS_LMAN_SYM_OUTLINE: -50,50,50,-50; FP_TECH: TK2; IP: GENERIC; ROOM: NONE; OriginalSymbolOrigin: (-50,25); XY: (-450,4000); VER: 1; ROT: 0; PHYS_PAGE: 162; LOCATION: C16216; DRAWING: @RVP1_ADL_SB_ADP_S_DDR5_SODIMM_2DPC_LIB.H55_DG2_2DPC(SCH_1):PAGE531; CDS_LIB: c_discrete; VARIANT: ?; PCB Footprint: CTK2_SM0402_1200X700_MA; CHIPS_PART_NAME: C_CAP; CDS_PART_NAME: C_CAP_0402-H64201-001,EMPTY,10UF,10V,20%,TK2,GENERIC; CDS_LOCATION: C16216
C16301 = C_CAP: CDS_PHYS_PART_NAME: C_CAP_0402-A36096-027,X5R,1UF,6.3V,10%,TK0,GENERIC; CDS_LMAN_SYM_OUTLINE: -50,50,50,-50; FP_TECH: TK0; IP: GENERIC; ROOM: NONE; OriginalSymbolOrigin: (-50,25); XY: (-1050,5125); VER: 1; ROT: 0; PHYS_PAGE: 162; LOCATION: C16301; FIN: VREG_CPU_DCPL; DRAWING: @RVP1_ADL_SB_ADP_S_DDR5_SODIMM_2DPC_LIB.H55_DG2_2DPC(SCH_1):PAGE531; CDS_LIB: c_discrete; BOM: CORE_VREG_CPU; VARIANT: ?; PCB Footprint: CTK0_SM0402_1050X550_MA; CHIPS_PART_NAME: C_CAP; CDS_PART_NAME: C_CAP_0402-A36096-027,X5R,1UF,6.3V,10%,TK0,GENERIC; CDS_LOCATION: C16301
C16302 = C_CAP: CDS_PHYS_PART_NAME: C_CAP_0603-656725-014,EMPTY,47UF,6.3V,20%,TK0,GENERIC; CDS_LMAN_SYM_OUTLINE: -50,50,50,-50; FP_TECH: TK0; IP: GENERIC; ROOM: NONE; OriginalSymbolOrigin: (-50,25); XY: (-4725,4125); VER: 1; ROT: 0; PHYS_PAGE: 162; LOCATION: C16302; DRAWING: @RVP1_ADL_SB_ADP_S_DDR5_SODIMM_2DPC_LIB.H55_DG2_2DPC(SCH_1):PAGE531; CDS_LIB: c_discrete; VARIANT: ?; PCB Footprint: CTK0_SM0603_1800X1000_MA; CHIPS_PART_NAME: C_CAP; CDS_PART_NAME: C_CAP_0603-656725-014,EMPTY,47UF,6.3V,20%,TK0,GENERIC; CDS_LOCATION: C16302